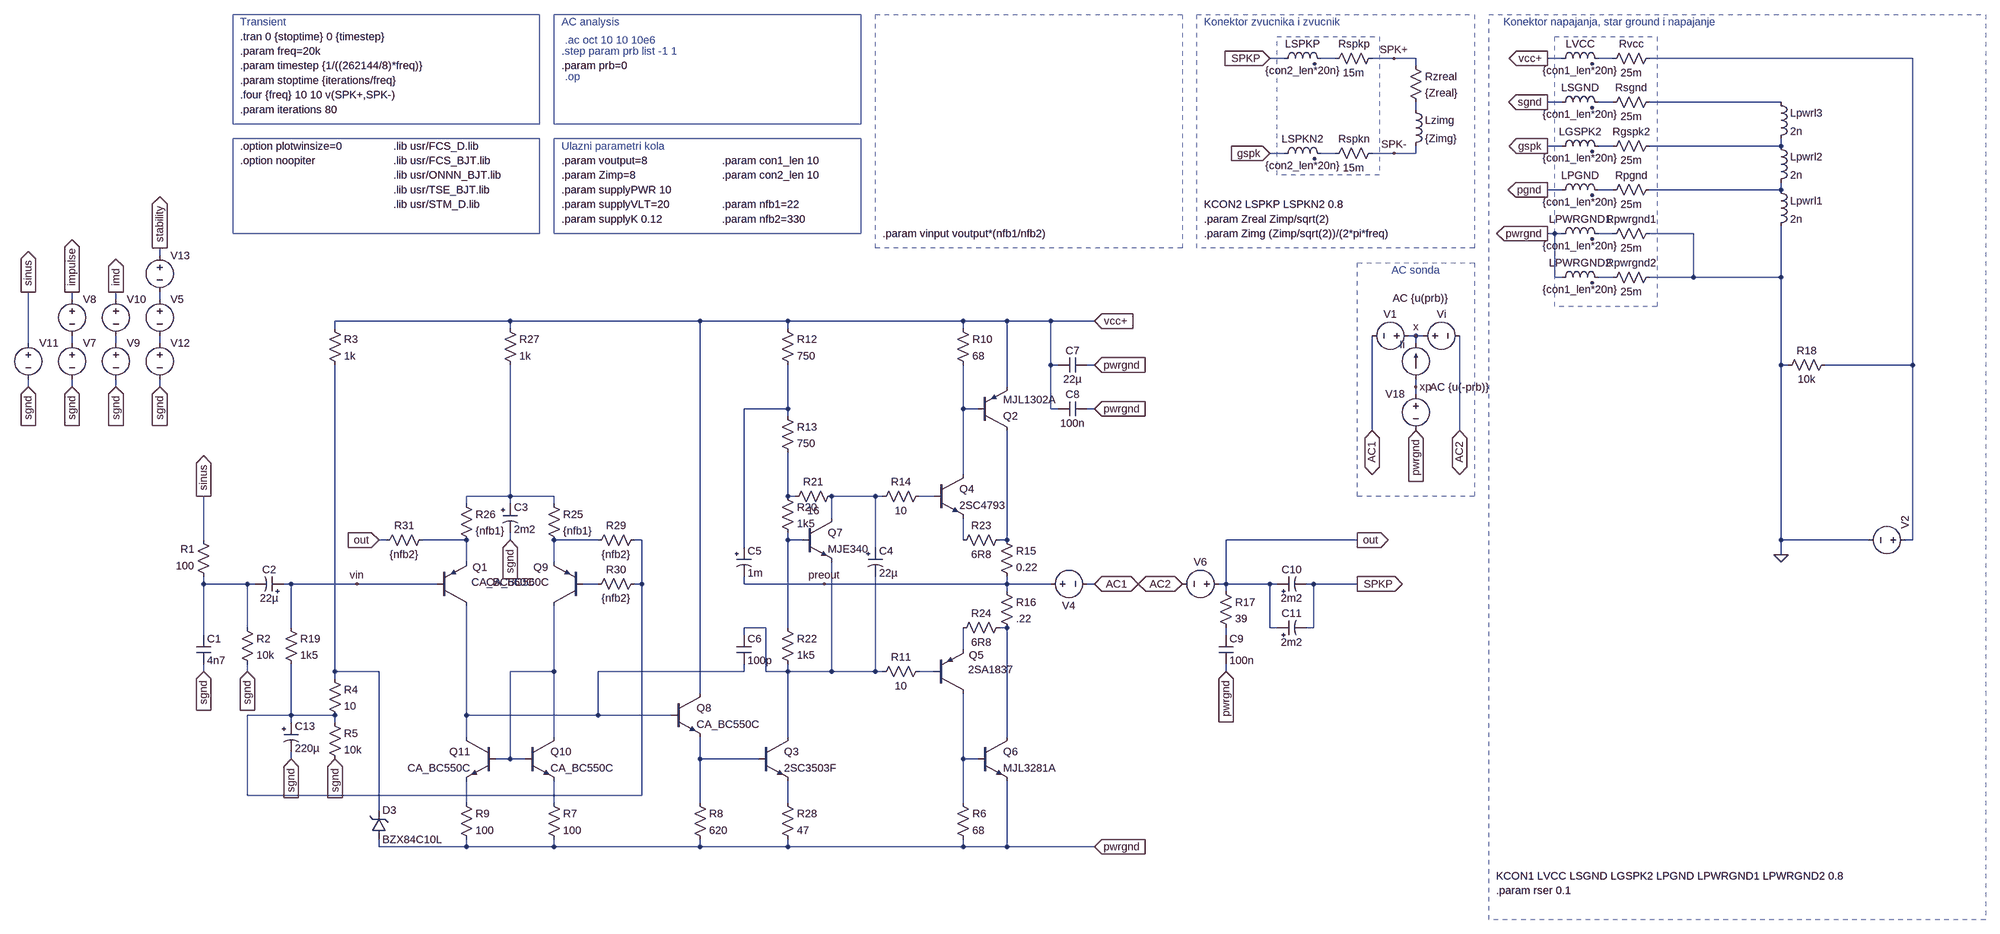
[diagram p0: schematic pa3bbb-compact.asc]
pa3bbb-compact.asc, the LTspice schematic file:
Version 4
SHEET 1 6124 2336
WIRE 2272 -1536 2240 -1536
WIRE 2384 -1536 2352 -1536
WIRE 2512 -1536 2464 -1536
WIRE 2560 -1536 2512 -1536
WIRE 2880 -1536 2848 -1536
WIRE 2992 -1536 2960 -1536
WIRE 3648 -1536 3072 -1536
WIRE 2560 -1520 2560 -1536
WIRE 2880 -1440 2848 -1440
WIRE 2992 -1440 2960 -1440
WIRE 3360 -1440 3072 -1440
WIRE 2560 -1424 2560 -1440
WIRE 2880 -1344 2848 -1344
WIRE 2992 -1344 2960 -1344
WIRE 3360 -1344 3360 -1360
WIRE 3360 -1344 3072 -1344
WIRE 2272 -1328 2240 -1328
WIRE 2384 -1328 2352 -1328
WIRE 2512 -1328 2464 -1328
WIRE 2560 -1328 2560 -1344
WIRE 2560 -1328 2512 -1328
WIRE 2880 -1248 2848 -1248
WIRE 2992 -1248 2960 -1248
WIRE 3360 -1248 3360 -1264
WIRE 3360 -1248 3072 -1248
WIRE 2864 -1152 2848 -1152
WIRE 2880 -1152 2864 -1152
WIRE 2992 -1152 2960 -1152
WIRE 3168 -1152 3072 -1152
WIRE -192 -1104 -192 -1120
WIRE 2864 -1056 2864 -1152
WIRE 2880 -1056 2864 -1056
WIRE 2992 -1056 2960 -1056
WIRE 3168 -1056 3168 -1152
WIRE 3168 -1056 3072 -1056
WIRE 3360 -1056 3360 -1168
WIRE 3360 -1056 3168 -1056
WIRE -384 -1008 -384 -1024
WIRE -288 -1008 -288 -1024
WIRE -192 -1008 -192 -1024
WIRE 576 -960 192 -960
WIRE 992 -960 576 -960
WIRE 1184 -960 992 -960
WIRE 1568 -960 1184 -960
WIRE 1664 -960 1568 -960
WIRE 1760 -960 1664 -960
WIRE 1856 -960 1760 -960
WIRE 192 -944 192 -960
WIRE 576 -944 576 -960
WIRE 1184 -944 1184 -960
WIRE 1568 -944 1568 -960
WIRE 2560 -928 2544 -928
WIRE 2576 -928 2560 -928
WIRE -480 -912 -480 -1024
WIRE -384 -912 -384 -928
WIRE -288 -912 -288 -928
WIRE -192 -912 -192 -928
WIRE 2560 -912 2560 -928
WIRE 1760 -864 1760 -960
WIRE 1776 -864 1760 -864
WIRE 1856 -864 1840 -864
WIRE 3360 -864 3360 -1056
WIRE 3376 -864 3360 -864
WIRE 3648 -864 3648 -1536
WIRE 3648 -864 3456 -864
WIRE -480 -816 -480 -832
WIRE -384 -816 -384 -832
WIRE -288 -816 -288 -832
WIRE -192 -816 -192 -832
WIRE 1664 -816 1664 -960
WIRE 2560 -816 2560 -832
WIRE 2560 -800 2560 -816
WIRE 1184 -768 1184 -864
WIRE 1184 -768 1088 -768
WIRE 1568 -768 1568 -864
WIRE 1600 -768 1568 -768
WIRE 1760 -768 1760 -864
WIRE 1776 -768 1760 -768
WIRE 1856 -768 1840 -768
WIRE 1184 -752 1184 -768
WIRE 2464 -720 2464 -928
WIRE 2656 -720 2656 -928
WIRE 1568 -624 1568 -768
WIRE 576 -576 576 -864
WIRE 576 -576 480 -576
WIRE 672 -576 576 -576
WIRE 1184 -576 1184 -672
WIRE 1200 -576 1184 -576
WIRE 1376 -576 1280 -576
WIRE 1392 -576 1376 -576
WIRE 1504 -576 1472 -576
WIRE 480 -560 480 -576
WIRE 576 -560 576 -576
WIRE 672 -560 672 -576
WIRE 1280 -528 1280 -576
WIRE -96 -480 -96 -576
WIRE 304 -480 288 -480
WIRE 480 -480 384 -480
WIRE 576 -480 576 -496
WIRE 768 -480 672 -480
WIRE 864 -480 848 -480
WIRE 1184 -480 1184 -496
WIRE 1216 -480 1184 -480
WIRE 1568 -480 1568 -528
WIRE 1664 -480 1664 -720
WIRE 1664 -480 1648 -480
WIRE 2432 -480 2144 -480
WIRE 3360 -480 3360 -864
WIRE 3552 -480 3360 -480
WIRE 3648 -480 3648 -864
WIRE 3648 -480 3632 -480
WIRE 1088 -464 1088 -768
WIRE 1376 -464 1376 -576
WIRE 3360 -448 3360 -480
WIRE 480 -432 480 -480
WIRE 672 -432 672 -480
WIRE -96 -384 -96 -400
WIRE 0 -384 -96 -384
WIRE 16 -384 0 -384
WIRE 96 -384 80 -384
WIRE 240 -384 96 -384
WIRE 416 -384 240 -384
WIRE 768 -384 736 -384
WIRE 864 -384 864 -480
WIRE 864 -384 848 -384
WIRE 1088 -384 1088 -400
WIRE 1264 -384 1088 -384
WIRE 1664 -384 1664 -400
WIRE 1664 -384 1264 -384
WIRE 1760 -384 1664 -384
WIRE 1856 -384 1840 -384
WIRE 2144 -384 2144 -480
WIRE 2144 -384 2128 -384
WIRE 2240 -384 2144 -384
WIRE 2256 -384 2240 -384
WIRE 2336 -384 2320 -384
WIRE 2432 -384 2336 -384
WIRE 1664 -368 1664 -384
WIRE 2144 -368 2144 -384
WIRE 0 -288 0 -384
WIRE 96 -288 96 -384
WIRE 1136 -288 1088 -288
WIRE 1184 -288 1184 -480
WIRE 1664 -288 1648 -288
WIRE 2240 -288 2240 -384
WIRE 2256 -288 2240 -288
WIRE 2336 -288 2336 -384
WIRE 2336 -288 2320 -288
WIRE -96 -272 -96 -384
WIRE 1088 -272 1088 -288
WIRE 2144 -272 2144 -288
WIRE 1568 -240 1568 -288
WIRE -96 -192 -96 -208
WIRE 0 -192 0 -208
WIRE 192 -192 192 -864
WIRE 288 -192 192 -192
WIRE 672 -192 672 -336
WIRE 672 -192 576 -192
WIRE 1088 -192 1088 -208
WIRE 1088 -192 768 -192
WIRE 1136 -192 1136 -288
WIRE 1184 -192 1184 -208
WIRE 1184 -192 1136 -192
WIRE 1280 -192 1280 -432
WIRE 1280 -192 1184 -192
WIRE 1376 -192 1376 -400
WIRE 1376 -192 1280 -192
WIRE 1392 -192 1376 -192
WIRE 1504 -192 1472 -192
WIRE 2144 -192 2144 -208
WIRE 192 -176 192 -192
WIRE 992 -144 992 -960
WIRE 96 -96 96 -208
WIRE 96 -96 0 -96
WIRE 192 -96 96 -96
WIRE 480 -96 480 -336
WIRE 768 -96 768 -192
WIRE 768 -96 480 -96
WIRE 928 -96 768 -96
WIRE 96 -80 96 -96
WIRE 192 -80 192 -96
WIRE 480 -48 480 -96
WIRE 672 -48 672 -192
WIRE 1184 -48 1184 -192
WIRE 1664 -48 1664 -288
WIRE 96 0 96 -16
WIRE 576 0 576 -192
WIRE 576 0 544 0
WIRE 608 0 576 0
WIRE 992 0 992 -48
WIRE 1120 0 992 0
WIRE 1568 0 1568 -144
WIRE 1600 0 1568 0
WIRE 0 80 0 -96
WIRE 864 80 864 -384
WIRE 864 80 0 80
WIRE 480 96 480 48
WIRE 672 96 672 48
WIRE 992 96 992 0
WIRE 1184 96 1184 48
WIRE 1568 96 1568 0
WIRE 288 112 288 -192
WIRE 288 192 288 176
WIRE 480 192 480 176
WIRE 480 192 288 192
WIRE 672 192 672 176
WIRE 672 192 480 192
WIRE 992 192 992 176
WIRE 992 192 672 192
WIRE 1184 192 1184 176
WIRE 1184 192 992 192
WIRE 1568 192 1568 176
WIRE 1568 192 1184 192
WIRE 1664 192 1664 48
WIRE 1664 192 1568 192
WIRE 1856 192 1664 192
FLAG 1856 -960 vcc+
IOPIN 1856 -960 In
FLAG 2560 -928 x
FLAG 2432 -480 out
IOPIN 2432 -480 Out
FLAG 2560 -816 xp
FLAG 2144 -192 pwrgnd
IOPIN 2144 -192 In
FLAG -480 -816 sgnd
IOPIN -480 -816 In
FLAG -480 -1024 sinus
IOPIN -480 -1024 Out
FLAG 2848 -1536 vcc+
IOPIN 2848 -1536 Out
FLAG 2848 -1344 gspk
IOPIN 2848 -1344 Out
FLAG 2848 -1248 pgnd
IOPIN 2848 -1248 Out
FLAG 2848 -1440 sgnd
IOPIN 2848 -1440 Out
FLAG 2432 -384 SPKP
IOPIN 2432 -384 Out
FLAG 2240 -1328 gspk
IOPIN 2240 -1328 In
FLAG 2240 -1536 SPKP
IOPIN 2240 -1536 In
FLAG 2848 -1152 pwrgnd
IOPIN 2848 -1152 Out
FLAG 3360 -448 0
FLAG 2464 -720 AC1
IOPIN 2464 -720 BiDir
FLAG 2656 -720 AC2
IOPIN 2656 -720 BiDir
FLAG 1856 -384 AC1
IOPIN 1856 -384 BiDir
FLAG 2048 -384 AC2
IOPIN 2048 -384 BiDir
FLAG 2560 -720 pwrgnd
IOPIN 2560 -720 In
FLAG 2512 -1536 SPK+
FLAG 2512 -1328 SPK-
FLAG -288 -1024 imd
IOPIN -288 -1024 Out
FLAG 1856 -768 pwrgnd
IOPIN 1856 -768 In
FLAG -384 -816 sgnd
IOPIN -384 -816 In
FLAG -288 -816 sgnd
IOPIN -288 -816 In
FLAG 1264 -384 preout
FLAG 0 -192 sgnd
IOPIN 0 -192 In
FLAG 1856 -864 pwrgnd
IOPIN 1856 -864 In
FLAG -192 -1120 stability
IOPIN -192 -1120 Out
FLAG -192 -816 sgnd
IOPIN -192 -816 In
FLAG 1856 192 pwrgnd
IOPIN 1856 192 In
FLAG -96 -192 sgnd
IOPIN -96 -192 In
FLAG 576 -480 sgnd
IOPIN 576 -480 In
FLAG -384 -1024 impulse
IOPIN -384 -1024 Out
FLAG 240 -384 vin
FLAG 192 0 sgnd
IOPIN 192 0 In
FLAG 96 0 sgnd
IOPIN 96 0 In
FLAG -96 -576 sinus
IOPIN -96 -576 Out
FLAG 288 -480 out
IOPIN 288 -480 In
DATAFLAG 1488 -960 ""
DATAFLAG 1760 192 ""
DATAFLAG 1712 -384 ""
DATAFLAG 1184 32 "Ic(Q3)"
DATAFLAG 240 -192 ""
SYMBOL current 2560 -832 R180
WINDOW 0 24 77 Left 2
WINDOW 3 24 0 Invisible 2
WINDOW 123 -71 178 Left 2
WINDOW 39 0 0 Left 2
SYMATTR InstName Ii
SYMATTR Value 0
SYMATTR Value2 AC {u(prb)}
SYMBOL voltage 2560 -928 R270
WINDOW 0 32 56 VTop 2
WINDOW 3 -32 56 Invisible 2
WINDOW 123 -97 96 VBottom 2
WINDOW 39 -32 56 VBottom 2
SYMATTR InstName Vi
SYMATTR Value 0
SYMATTR Value2 AC {u(-prb)}
SYMBOL pnp 416 -336 M180
WINDOW 0 77 84 Left 2
WINDOW 3 75 52 Left 2
SYMATTR InstName Q1
SYMATTR Value CA_BC560C
SYMBOL res -80 -384 R180
WINDOW 0 36 76 Left 2
WINDOW 3 36 40 Left 2
SYMATTR InstName R1
SYMATTR Value 100
SYMBOL res 464 80 R0
SYMATTR InstName R9
SYMATTR Value 100
SYMBOL voltage 2560 -928 R90
WINDOW 0 -32 56 VBottom 2
WINDOW 3 32 56 Invisible 2
WINDOW 123 0 0 Left 2
WINDOW 39 0 0 Left 2
SYMATTR InstName V1
SYMATTR Value 0
SYMBOL res 2128 -384 R0
SYMATTR InstName R17
SYMATTR Value 39
SYMBOL res 2544 -1536 R0
SYMATTR InstName Rzreal
SYMATTR Value {Zreal}
SYMBOL ind 2544 -1440 R0
SYMATTR InstName Lzimg
SYMATTR Value {Zimg}
SYMATTR SpiceLine Cpar=10p
SYMBOL voltage 2560 -816 M0
WINDOW 123 0 0 Left 2
WINDOW 39 0 0 Left 2
WINDOW 3 24 96 Invisible 2
SYMATTR Value 0
SYMATTR InstName V18
SYMBOL cap 1776 -784 M90
WINDOW 0 0 32 VBottom 2
WINDOW 3 32 32 VTop 2
SYMATTR InstName C8
SYMATTR Value 100n
SYMATTR SpiceLine Rser=300m Lser=3n Rpar=4.4meg Cpar=1p
SYMBOL cap 2128 -272 R0
SYMATTR InstName C9
SYMATTR Value 100n
SYMATTR SpiceLine Rser=700m Lser=7n Rpar=4.4meg Cpar=1p
SYMBOL polcap 560 -560 R0
SYMATTR InstName C3
SYMATTR Value 2m2
SYMATTR SpiceLine V=6.3 Irms=1.44 Rser=0.09 Lser=5.5n Rpar=3310k Cpar=3p
SYMATTR Description Capacitor
SYMATTR Type cap
SYMBOL ind2 2864 -1520 R270
WINDOW 0 32 56 VTop 2
WINDOW 3 5 56 VBottom 2
SYMATTR InstName LVCC
SYMATTR Value {con1_len*20n}
SYMATTR SpiceLine Rser={con1_len*.5m}
SYMATTR Type ind
SYMBOL voltage -480 -928 R0
WINDOW 123 24 44 Left 2
WINDOW 39 0 0 Left 2
WINDOW 3 24 96 Invisible 2
SYMATTR Value SINE(0 {vinput} {freq} 0 0 0)
SYMATTR InstName V11
SYMBOL ind2 2864 -1328 R270
WINDOW 0 32 56 VTop 2
WINDOW 3 5 56 VBottom 2
SYMATTR InstName LGSPK2
SYMATTR Value {con1_len*20n}
SYMATTR SpiceLine Rser={con1_len*.5m}
SYMATTR Type ind
SYMBOL ind2 2864 -1040 R270
WINDOW 0 32 56 VTop 2
WINDOW 3 5 56 VBottom 2
SYMATTR InstName LPWRGND2
SYMATTR Value {con1_len*20n}
SYMATTR SpiceLine Rser={con1_len*.5m}
SYMATTR Type ind
SYMBOL ind2 2864 -1232 R270
WINDOW 0 32 56 VTop 2
WINDOW 3 5 56 VBottom 2
SYMATTR InstName LPGND
SYMATTR Value {con1_len*20n}
SYMATTR SpiceLine Rser={con1_len*.5m}
SYMATTR Type ind
SYMBOL ind2 2864 -1424 R270
WINDOW 0 32 56 VTop 2
WINDOW 3 5 56 VBottom 2
SYMATTR InstName LSGND
SYMATTR Value {con1_len*20n}
SYMATTR SpiceLine Rser={con1_len*.5m}
SYMATTR Type ind
SYMBOL res 3088 -1552 R90
WINDOW 0 0 56 VBottom 2
WINDOW 3 32 56 VTop 2
SYMATTR InstName Rvcc
SYMATTR Value 25m
SYMBOL res 3088 -1360 R90
WINDOW 0 0 56 VBottom 2
WINDOW 3 32 56 VTop 2
SYMATTR InstName Rgspk2
SYMATTR Value 25m
SYMBOL res 3088 -1072 R90
WINDOW 0 0 56 VBottom 2
WINDOW 3 32 56 VTop 2
SYMATTR InstName Rpwrgnd2
SYMATTR Value 25m
SYMBOL res 3088 -1264 R90
WINDOW 0 0 56 VBottom 2
WINDOW 3 32 56 VTop 2
SYMATTR InstName Rpgnd
SYMATTR Value 25m
SYMBOL res 3088 -1456 R90
WINDOW 0 0 56 VBottom 2
WINDOW 3 32 56 VTop 2
SYMATTR InstName Rsgnd
SYMATTR Value 25m
SYMBOL ind 3344 -1264 R0
SYMATTR InstName Lpwrl1
SYMATTR Value 2n
SYMATTR SpiceLine Rser=1m
SYMBOL ind 3344 -1360 R0
SYMATTR InstName Lpwrl2
SYMATTR Value 2n
SYMATTR SpiceLine Rser=1m
SYMBOL ind 3344 -1456 R0
SYMATTR InstName Lpwrl3
SYMATTR Value 2n
SYMATTR SpiceLine Rser=1m
SYMBOL ind2 2256 -1520 R270
WINDOW 0 32 56 VTop 2
WINDOW 3 5 56 VBottom 2
SYMATTR InstName LSPKP
SYMATTR Value {con2_len*20n}
SYMATTR SpiceLine Rser={con2_len*.5m}
SYMATTR Type ind
SYMBOL ind2 2256 -1312 R270
WINDOW 0 32 56 VTop 2
WINDOW 3 5 56 VBottom 2
SYMATTR InstName LSPKN2
SYMATTR Value {con2_len*20n}
SYMATTR SpiceLine Rser={con2_len*.5m}
SYMATTR Type ind
SYMBOL res 2480 -1552 R90
WINDOW 0 0 56 VBottom 2
WINDOW 3 32 56 VTop 2
SYMATTR InstName Rspkp
SYMATTR Value 15m
SYMBOL res 2480 -1344 R90
WINDOW 0 0 56 VBottom 2
WINDOW 3 32 56 VTop 2
SYMATTR InstName Rspkn
SYMATTR Value 15m
SYMBOL ind2 2864 -1136 R270
WINDOW 0 32 56 VTop 2
WINDOW 3 5 56 VBottom 2
SYMATTR InstName LPWRGND1
SYMATTR Value {con1_len*20n}
SYMATTR SpiceLine Rser={con1_len*.5m}
SYMATTR Type ind
SYMBOL res 3088 -1168 R90
WINDOW 0 0 56 VBottom 2
WINDOW 3 32 56 VTop 2
SYMATTR InstName Rpwrgnd1
SYMATTR Value 25m
SYMBOL voltage -384 -928 R0
WINDOW 3 24 96 Invisible 2
WINDOW 123 0 0 Left 2
WINDOW 39 0 0 Left 2
SYMATTR Value PULSE(0 {vinput/2} 1u 1n 1n {1/(freq*2)} {1/freq})
SYMATTR InstName V7
SYMBOL voltage -384 -1024 R0
WINDOW 3 24 96 Invisible 2
WINDOW 123 0 0 Left 2
WINDOW 39 0 0 Left 2
SYMATTR Value PULSE(0 {-vinput/2} {1u+(1/(freq*2))} 1n 1n {1/(freq*2)} {1/freq})
SYMATTR InstName V8
SYMBOL polcap 80 -368 M270
WINDOW 3 0 32 VBottom 2
WINDOW 0 32 32 VTop 2
SYMATTR Value 22µ
SYMATTR InstName C2
SYMATTR SpiceLine V=6.3 Irms=290m Rser=0.5 Lser=3n Rpar=2100k Cpar=3p
SYMATTR Description Capacitor
SYMATTR Type cap
SYMBOL voltage 1744 -384 R270
WINDOW 0 -32 56 VBottom 2
WINDOW 3 32 56 Invisible 2
WINDOW 123 0 0 Left 2
WINDOW 39 0 0 Left 2
SYMATTR InstName V4
SYMATTR Value 0
SYMBOL voltage 2144 -384 R90
WINDOW 0 -32 56 VBottom 2
WINDOW 3 32 56 Invisible 2
WINDOW 123 0 0 Left 2
WINDOW 39 0 0 Left 2
SYMATTR InstName V6
SYMATTR Value 0
SYMBOL voltage -288 -928 R0
WINDOW 3 24 96 Invisible 2
WINDOW 123 0 0 Left 2
WINDOW 39 0 0 Left 2
SYMATTR Value SINE(0 {vinput/2} 19k)
SYMATTR InstName V9
SYMBOL voltage -288 -1024 R0
WINDOW 3 24 96 Invisible 2
WINDOW 123 0 0 Left 2
WINDOW 39 0 0 Left 2
SYMATTR Value SINE(0 {vinput/2} 20k 0 0)
SYMATTR InstName V10
SYMBOL res 1648 -384 R0
SYMATTR InstName R16
SYMATTR Value .22
SYMBOL res 1648 -496 R0
SYMATTR InstName R15
SYMATTR Value 0.22
SYMBOL npn 1120 -48 R0
SYMATTR InstName Q3
SYMATTR Value 2SC3503F
SYMBOL cap 1072 -272 R0
SYMATTR InstName C6
SYMATTR Value 100p
SYMATTR SpiceLine Rser=.3 Lser=6n Rpar=3.9meg Cpar=1p
SYMBOL res 3472 -880 R90
WINDOW 0 0 56 VBottom 2
WINDOW 3 32 56 VTop 2
SYMATTR InstName R18
SYMATTR Value 10k
SYMBOL cap -112 -208 M180
WINDOW 0 24 56 Left 2
WINDOW 3 24 8 Left 2
SYMATTR InstName C1
SYMATTR Value 4n7
SYMATTR SpiceLine Rser=.15 Lser=5n Rpar=3meg Cpar=2p
SYMBOL cap 1776 -880 M90
WINDOW 0 0 32 VBottom 2
WINDOW 3 32 32 VTop 2
SYMATTR InstName C7
SYMATTR Value 22µ
SYMATTR SpiceLine Rser=80m Lser=6n Rpar=4.4meg Cpar=1p
SYMBOL voltage -192 -1120 R0
WINDOW 123 24 44 Left 2
WINDOW 39 0 0 Left 2
WINDOW 3 24 96 Invisible 2
SYMATTR Value SINE(0 {7*vinput/8} {freq} 0 0 0)
SYMATTR InstName V13
SYMBOL voltage -192 -1024 R0
WINDOW 3 24 96 Invisible 2
WINDOW 123 0 0 Left 2
WINDOW 39 0 0 Left 2
SYMATTR Value PULSE(0 {-vinput/8} {1u+(1/(freq*80))} 1n 1n {1/(freq*80)} {1/(freq*40)})
SYMATTR InstName V5
SYMBOL voltage -192 -928 R0
WINDOW 3 24 96 Invisible 2
WINDOW 123 0 0 Left 2
WINDOW 39 0 0 Left 2
SYMATTR Value PULSE(0 {vinput/8} 1u 1n 1n {1/(freq*80)} {1/(freq*40)})
SYMATTR InstName V12
SYMBOL res 1168 -768 R0
SYMATTR InstName R13
SYMATTR Value 750
SYMBOL npn 1600 -48 R0
SYMATTR InstName Q6
SYMATTR Value MJL3281A
SYMBOL res 1168 -960 R0
SYMATTR InstName R12
SYMATTR Value 750
SYMBOL res 1488 -592 R90
WINDOW 0 0 56 VBottom 2
WINDOW 3 32 56 VTop 2
SYMATTR InstName R14
SYMATTR Value 10
SYMBOL res 1488 -208 R90
WINDOW 0 0 56 VBottom 2
WINDOW 3 32 56 VTop 2
SYMATTR InstName R11
SYMATTR Value 10
SYMBOL voltage 3648 -480 M270
WINDOW 123 24 -12 Left 2
WINDOW 3 24 -12 Invisible 2
SYMATTR Value {supplyVLT}
SYMATTR SpiceLine Rser={rser}
SYMATTR InstName V2
SYMBOL polcap 2256 -368 R270
WINDOW 0 32 32 VTop 2
WINDOW 3 0 32 VBottom 2
SYMATTR InstName C10
SYMATTR Value 2m2
SYMATTR SpiceLine V=6.3 Irms=1.44 Rser=0.09 Lser=5.5n Rpar=3310k Cpar=3p
SYMATTR Description Capacitor
SYMATTR Type cap
SYMBOL res 176 -96 R0
SYMATTR InstName R5
SYMATTR Value 10k
SYMBOL res 176 -192 R0
SYMATTR InstName R4
SYMATTR Value 10
SYMBOL zener 272 176 M180
WINDOW 0 24 64 Left 2
WINDOW 3 24 0 Left 2
SYMATTR InstName D3
SYMATTR Value BZX84C10L
SYMATTR Description Diode
SYMATTR Type diode
SYMBOL polcap 1072 -464 R0
SYMATTR InstName C5
SYMATTR Value 1m
SYMATTR SpiceLine V=6.3 Irms=1.44 Rser=0.09 Lser=5.5n Rpar=3310k Cpar=3p
SYMATTR Description Capacitor
SYMATTR Type cap
SYMBOL res -16 -304 R0
SYMATTR InstName R2
SYMATTR Value 10k
SYMBOL polcap 2256 -272 R270
WINDOW 0 32 32 VTop 2
WINDOW 3 0 32 VBottom 2
SYMATTR InstName C11
SYMATTR Value 2m2
SYMATTR SpiceLine V=6.3 Irms=1.44 Rser=0.09 Lser=5.5n Rpar=3310k Cpar=3p
SYMATTR Description Capacitor
SYMATTR Type cap
SYMBOL res 176 -960 R0
SYMATTR InstName R3
SYMATTR Value 1k
SYMBOL pnp 1600 -720 M180
SYMATTR InstName Q2
SYMATTR Value MJL1302A
SYMBOL res 1552 80 R0
SYMATTR InstName R6
SYMATTR Value 68
SYMBOL res 1552 -960 R0
SYMATTR InstName R10
SYMATTR Value 68
SYMBOL npn 1504 -624 R0
SYMATTR InstName Q4
SYMATTR Value 2SC4793
SYMBOL pnp 1504 -144 M180
WINDOW 0 77 84 Left 2
WINDOW 3 75 52 Left 2
SYMATTR InstName Q5
SYMATTR Value 2SA1837
SYMBOL res 80 -304 R0
SYMATTR InstName R19
SYMATTR Value 1k5
SYMBOL polcap 80 -80 R0
SYMATTR InstName C13
SYMATTR Value 220µ
SYMATTR SpiceLine V=6.3 Irms=1.44 Rser=0.09 Lser=5.5n Rpar=3310k Cpar=3p
SYMATTR Description Capacitor
SYMATTR Type cap
SYMBOL npn 1216 -528 R0
SYMATTR InstName Q7
SYMATTR Value MJE340
SYMBOL res 1168 -592 R0
SYMATTR InstName R20
SYMATTR Value 1k5
SYMBOL res 1296 -592 R90
WINDOW 0 0 56 VBottom 2
WINDOW 3 32 56 VTop 2
SYMATTR InstName R21
SYMATTR Value 16
SYMBOL res 1168 -304 R0
SYMATTR InstName R22
SYMATTR Value 1k5
SYMBOL polcap 1360 -464 R0
SYMATTR Value 22µ
SYMATTR InstName C4
SYMATTR SpiceLine V=6.3 Irms=290m Rser=0.5 Lser=3n Rpar=2100k Cpar=3p
SYMATTR Description Capacitor
SYMATTR Type cap
SYMBOL res 1664 -496 R90
WINDOW 0 0 56 VBottom 2
WINDOW 3 32 56 VTop 2
SYMATTR InstName R23
SYMATTR Value 6R8
SYMBOL res 1664 -304 R90
WINDOW 0 0 56 VBottom 2
WINDOW 3 32 56 VTop 2
SYMATTR InstName R24
SYMATTR Value 6R8
SYMBOL pnp 736 -336 R180
WINDOW 0 77 84 Left 2
WINDOW 3 75 52 Left 2
SYMATTR InstName Q9
SYMATTR Value CA_BC560C
SYMBOL res 560 -960 R0
SYMATTR InstName R27
SYMATTR Value 1k
SYMBOL res 1168 80 R0
SYMATTR InstName R28
SYMATTR Value 47
SYMBOL res 864 -496 R90
WINDOW 0 0 56 VBottom 2
WINDOW 3 32 56 VTop 2
SYMATTR InstName R29
SYMATTR Value {nfb2}
SYMBOL res 864 -400 R90
WINDOW 0 0 56 VBottom 2
WINDOW 3 32 56 VTop 2
SYMATTR InstName R30
SYMATTR Value {nfb2}
SYMBOL res 656 -576 R0
SYMATTR InstName R25
SYMATTR Value {nfb1}
SYMBOL res 464 -576 R0
SYMATTR InstName R26
SYMATTR Value {nfb1}
SYMBOL res 400 -496 R90
WINDOW 0 0 56 VBottom 2
WINDOW 3 32 56 VTop 2
SYMATTR InstName R31
SYMATTR Value {nfb2}
SYMBOL res 656 80 R0
SYMATTR InstName R7
SYMATTR Value 100
SYMBOL npn 928 -144 R0
SYMATTR InstName Q8
SYMATTR Value CA_BC550C
SYMBOL res 976 80 R0
SYMATTR InstName R8
SYMATTR Value 620
SYMBOL npn 608 -48 R0
SYMATTR InstName Q10
SYMATTR Value CA_BC550C
SYMBOL npn 544 -48 M0
SYMATTR InstName Q11
SYMATTR Value CA_BC550C
TEXT -16 -1344 Left 2 !.option plotwinsize=0
TEXT -16 -1312 Left 2 !.option noopiter
TEXT -16 -1616 Left 2 ;Transient
TEXT -16 -1456 Left 2 !.four {freq} 10 10 v(SPK+,SPK-)
TEXT 688 -1520 Left 2 !.param prb=0
TEXT -16 -1520 Left 2 !.param timestep {1/((262144/8)*freq)}
TEXT -16 -1552 Left 2 !.param freq=20k
TEXT -16 -1488 Left 2 !.param stoptime {iterations/freq}
TEXT 688 -1552 Left 2 ;.step param prb list -1 1
TEXT 688 -1616 Left 2 ;AC analysis
TEXT -16 -1424 Left 2 !.param iterations 80
TEXT 320 -1280 Left 2 !.lib usr/ONNN_BJT.lib
TEXT 688 -1280 Left 2 !.param Zimp=8
TEXT 2096 -1184 Left 2 !.param Zreal Zimp/sqrt(2)
TEXT 2096 -1152 Left 2 !.param Zimg (Zimp/sqrt(2))/(2*pi*freq)
TEXT 688 -1248 Left 2 !.param supplyPWR 10
TEXT 688 -1216 Left 2 !.param supplyVLT=20
TEXT 320 -1216 Left 2 !.lib usr/STM_D.lib
TEXT 320 -1312 Left 2 !.lib usr/FCS_BJT.lib
TEXT 688 -1312 Left 2 !.param voutput=8
TEXT 688 -1184 Left 2 !.param supplyK 0.12
TEXT 2736 288 Left 2 !.param rser 0.1
TEXT -16 -1584 Left 2 !.tran 0 {stoptime} 0 {timestep}
TEXT 1040 -1312 Left 2 !.param con1_len 10
TEXT 2736 256 Left 2 !KCON1 LVCC LSGND LGSPK2 LPGND LPWRGND1 LPWRGND2 0.8
TEXT 1040 -1280 Left 2 !.param con2_len 10
TEXT 2096 -1216 Left 2 !KCON2 LSPKP LSPKN2 0.8
TEXT 2096 -1616 Left 2 ;Konektor zvucnika i zvucnik
TEXT 2752 -1616 Left 2 ;Konektor napajanja, star ground i napajanje
TEXT 688 -1344 Left 2 ;Ulazni parametri kola
TEXT 2560 -1072 Center 2 ;AC sonda
TEXT 320 -1344 Left 2 !.lib usr/FCS_D.lib
TEXT 1392 -1152 Left 2 !.param vinput voutput*(nfb1/nfb2)
TEXT 1040 -1216 Left 2 !.param nfb1=22
TEXT 1040 -1184 Left 2 !.param nfb2=330
TEXT 696 -1496 Left 2 ;.op
TEXT 696 -1576 Left 2 ;.ac oct 10 10 10e6
TEXT 320 -1248 Left 2 !.lib usr/TSE_BJT.lib
RECTANGLE Normal 640 -1632 -32 -1392
RECTANGLE Normal 640 -1152 -32 -1360
RECTANGLE Normal 1344 -1632 672 -1392
RECTANGLE Normal 2688 -1120 2080 -1632 2
RECTANGLE Normal 2688 -576 2432 -1088 2
RECTANGLE Normal 3088 -992 2864 -1584 2
RECTANGLE Normal 2480 -1280 2256 -1584 2
RECTANGLE Normal 2048 -1120 1376 -1632 2
RECTANGLE Normal 1344 -1360 672 -1152
RECTANGLE Normal 3808 352 2720 -1632 2

The netlist it stands for:
* pa3bbb-compact.asc
Ii xp x 0 AC {u(prb)}
Vi x AC2 0 AC {u(-prb)}
Q1 N038 vin N024 0 CA_BC560C
R1 N030 sinus 100
R9 N042 pwrgnd 100
V1 x AC1 0
R17 out N034 39
Rzreal SPK+ N006 {Zreal}
Lzimg N006 SPK- {Zimg} Cpar=10p
V18 xp pwrgnd 0
C8 vcc+ pwrgnd 100n Rser=300m Lser=3n Rpar=4.4meg Cpar=1p
C9 N034 pwrgnd 100n Rser=700m Lser=7n Rpar=4.4meg Cpar=1p
C3 N020 sgnd 2m2 V=6.3 Irms=1.44 Rser=0.09 Lser=5.5n Rpar=3310k Cpar=3p
LVCC vcc+ N002 {con1_len*20n} Rser={con1_len*.5m}
V11 sinus sgnd SINE(0 {vinput} {freq} 0 0 0)
LGSPK2 gspk N007 {con1_len*20n} Rser={con1_len*.5m}
LPWRGND2 pwrgnd N013 {con1_len*20n} Rser={con1_len*.5m}
LPGND pgnd N010 {con1_len*20n} Rser={con1_len*.5m}
LSGND sgnd N004 {con1_len*20n} Rser={con1_len*.5m}
Rvcc N003 N002 25m
Rgspk2 N008 N007 25m
Rpwrgnd2 0 N013 25m
Rpgnd N011 N010 25m
Rsgnd N005 N004 25m
Lpwrl1 N011 0 2n Rser=1m
Lpwrl2 N008 N011 2n Rser=1m
Lpwrl3 N005 N008 2n Rser=1m
LSPKP SPKP N001 {con2_len*20n} Rser={con2_len*.5m}
LSPKN2 gspk N009 {con2_len*20n} Rser={con2_len*.5m}
Rspkp SPK+ N001 15m
Rspkn SPK- N009 15m
LPWRGND1 pwrgnd N012 {con1_len*20n} Rser={con1_len*.5m}
Rpwrgnd1 0 N012 25m
V7 N015 sgnd PULSE(0 {vinput/2} 1u 1n 1n {1/(freq*2)} {1/freq})
V8 impulse N015 PULSE(0 {-vinput/2} {1u+(1/(freq*2))} 1n 1n {1/(freq*2)} {1/freq})
C2 vin N030 22µ V=6.3 Irms=290m Rser=0.5 Lser=3n Rpar=2100k Cpar=3p
V4 preout AC1 0
V6 out AC2 0
V9 N016 sgnd SINE(0 {vinput/2} 19k)
V10 imd N016 SINE(0 {vinput/2} 20k 0 0)
R16 preout N033 .22
R15 N029 preout 0.22
Q3 N032 N040 N044 0 2SC3503F
C6 N032 N038 100p Rser=.3 Lser=6n Rpar=3.9meg Cpar=1p
R18 N003 0 10k
C1 sgnd N030 4n7 Rser=.15 Lser=5n Rpar=3meg Cpar=2p
C7 vcc+ pwrgnd 22µ Rser=80m Lser=6n Rpar=4.4meg Cpar=1p
V13 stability N014 SINE(0 {7*vinput/8} {freq} 0 0 0)
V5 N014 N017 PULSE(0 {-vinput/8} {1u+(1/(freq*80))} 1n 1n {1/(freq*80)} {1/(freq*40)})
V12 N017 sgnd PULSE(0 {vinput/8} 1u 1n 1n {1/(freq*80)} {1/(freq*40)})
R13 N018 N021 750
Q6 N033 N041 pwrgnd 0 MJL3281A
R12 vcc+ N018 750
R14 N023 N022 10
R11 N039 N032 10
V2 N003 0 {supplyVLT} Rser={rser}
C10 out SPKP 2m2 V=6.3 Irms=1.44 Rser=0.09 Lser=5.5n Rpar=3310k Cpar=3p
R5 N026 sgnd 10k
R4 N036 N026 10
D3 pwrgnd N036 BZX84C10L
C5 N018 preout 1m V=6.3 Irms=1.44 Rser=0.09 Lser=5.5n Rpar=3310k Cpar=3p
R2 N030 sgnd 10k
C11 out SPKP 2m2 V=6.3 Irms=1.44 Rser=0.09 Lser=5.5n Rpar=3310k Cpar=3p
R3 vcc+ N036 1k
Q2 N029 N019 vcc+ 0 MJL1302A
R6 N041 pwrgnd 68
R10 vcc+ N019 68
Q4 N019 N023 N028 0 2SC4793
Q5 N041 N039 N035 0 2SA1837
R19 vin N026 1k5
C13 N026 sgnd 220µ V=6.3 Irms=1.44 Rser=0.09 Lser=5.5n Rpar=3310k Cpar=3p
Q7 N022 N027 N032 0 MJE340
R20 N021 N027 1k5
R21 N022 N021 16
R22 N027 N032 1k5
C4 N022 N032 22µ V=6.3 Irms=290m Rser=0.5 Lser=3n Rpar=2100k Cpar=3p
R23 N029 N028 6R8
R24 N033 N035 6R8
Q9 N037 N031 N025 0 CA_BC560C
R27 vcc+ N020 1k
R28 N044 pwrgnd 47
R29 N026 N025 {nfb2}
R30 N026 N031 {nfb2}
R25 N020 N025 {nfb1}
R26 N020 N024 {nfb1}
R31 N024 out {nfb2}
R7 N043 pwrgnd 100
Q8 vcc+ N038 N040 0 CA_BC550C
R8 N040 pwrgnd 620
Q10 N037 N037 N043 0 CA_BC550C
Q11 N038 N037 N042 0 CA_BC550C
.model D D
.lib standard.dio
.model NPN NPN
.model PNP PNP
.lib standard.bjt
.option plotwinsize=0
.option noopiter
* Transient
.four {freq} 10 10 v(SPK+,SPK-)
.param prb=0
.param timestep {1/((262144/8)*freq)}
.param freq=20k
.param stoptime {iterations/freq}
* .step param prb list -1 1
* AC analysis
.param iterations 80
.lib usr/ONNN_BJT.lib
.param Zimp=8
.param Zreal Zimp/sqrt(2)
.param Zimg (Zimp/sqrt(2))/(2*pi*freq)
.param supplyPWR 10
.param supplyVLT=20
.lib usr/STM_D.lib
.lib usr/FCS_BJT.lib
.param voutput=8
.param supplyK 0.12
.param rser 0.1
.tran 0 {stoptime} 0 {timestep}
.param con1_len 10
KCON1 LVCC LSGND LGSPK2 LPGND LPWRGND1 LPWRGND2 0.8
.param con2_len 10
KCON2 LSPKP LSPKN2 0.8
* Konektor zvucnika i zvucnik
* Konektor napajanja, star ground i napajanje
* Ulazni parametri kola
* AC sonda
.lib usr/FCS_D.lib
.param vinput voutput*(nfb1/nfb2)
.param nfb1=22
.param nfb2=330
* .op
* .ac oct 10 10 10e6
.lib usr/TSE_BJT.lib
.backanno
.end